# EAGLE design buttons_3 (EAGLE 5.09)
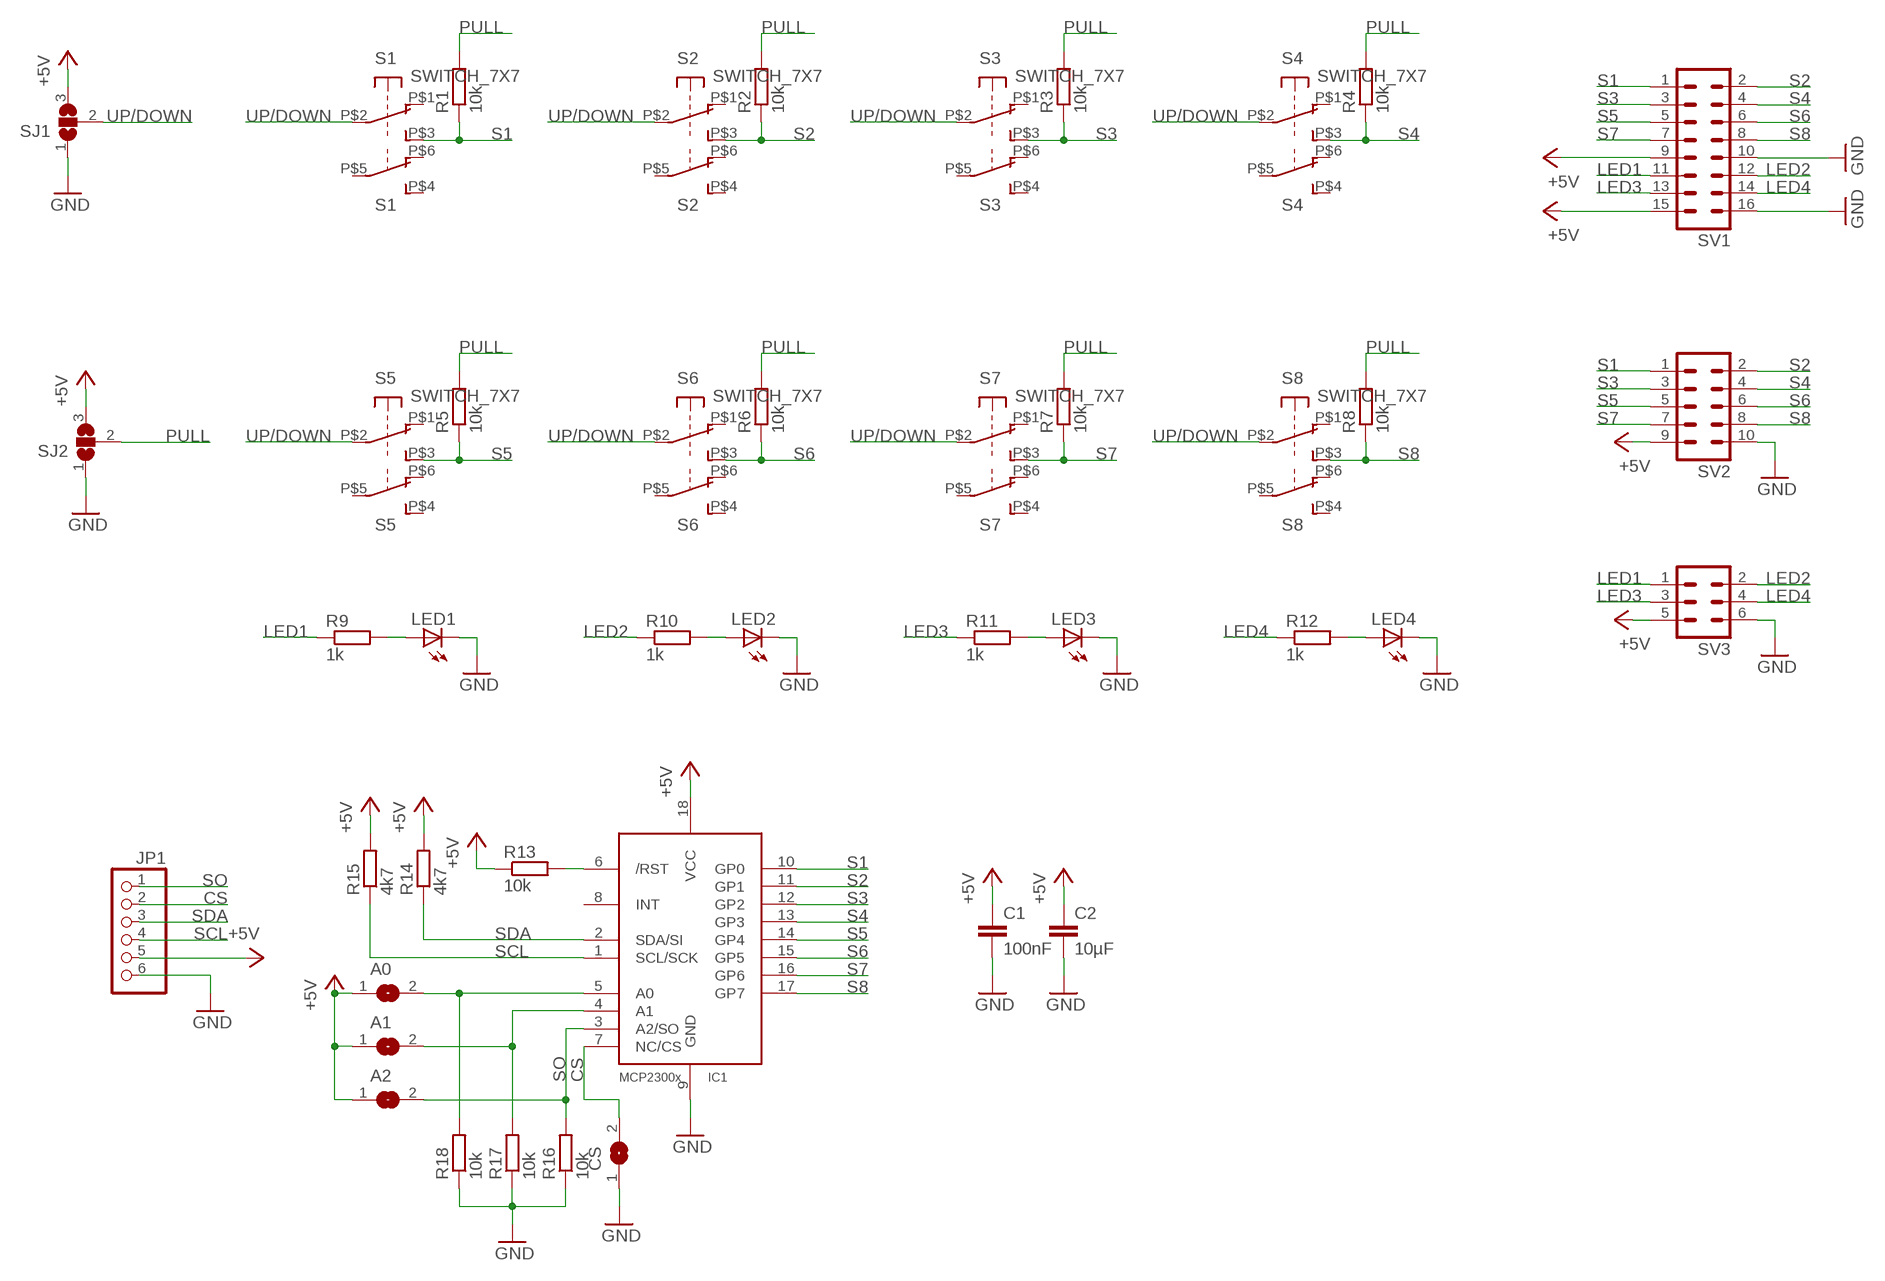
[diagram p0: schematic, sheet 1]

## Parts
A0  SJ  [SJ]
A1  SJ  [SJ]
A2  SJ  [SJ]
C1  100nF  C-EUC0805K  [C0805K]
C2  10µF  C-EUC0805K  [C0805K]
CS  SJ  [SJ]
IC1  MCP23008/MCP23S08/SO  [SO18W]
JP1  PINHD-1X6  [1X06]
LED1  LED5MM  [LED5MM]
LED2  LED5MM  [LED5MM]
LED3  LED5MM  [LED5MM]
LED4  LED5MM  [LED5MM]
R1  10k  R-EU_M0805  [M0805]
R2  10k  R-EU_M0805  [M0805]
R3  10k  R-EU_M0805  [M0805]
R4  10k  R-EU_M0805  [M0805]
R5  10k  R-EU_M0805  [M0805]
R6  10k  R-EU_M0805  [M0805]
R7  10k  R-EU_M0805  [M0805]
R8  10k  R-EU_M0805  [M0805]
R9  1k  R-EU_M0805  [M0805]
R10  1k  R-EU_M0805  [M0805]
R11  1k  R-EU_M0805  [M0805]
R12  1k  R-EU_M0805  [M0805]
R13  10k  R-EU_M0805  [M0805]
R14  4k7  R-EU_M0805  [M0805]
R15  4k7  R-EU_M0805  [M0805]
R16  10k  R-EU_M0805  [M0805]
R17  10k  R-EU_M0805  [M0805]
R18  10k  R-EU_M0805  [M0805]
S1  SWITCH_7X7  [SWITCH_7X7]
S2  SWITCH_7X7  [SWITCH_7X7]
S3  SWITCH_7X7  [SWITCH_7X7]
S4  SWITCH_7X7  [SWITCH_7X7]
S5  SWITCH_7X7  [SWITCH_7X7]
S6  SWITCH_7X7  [SWITCH_7X7]
S7  SWITCH_7X7  [SWITCH_7X7]
S8  SWITCH_7X7  [SWITCH_7X7]
SJ1  SJ2W  [SJ_2]
SJ2  SJ2W  [SJ_2]
SV1  ML16  [ML16]
SV2  ML10  [ML10]
SV3  ML6  [ML6]

## Nets
+5V: A0.1 A1.1 A2.1 C1.1 C2.1 IC1.18(VCC) JP1.5 R13.1 R14.2 R15.2 SJ1.3 SJ2.3 SV1.9 SV1.15 SV2.9 SV3.5
CS: CS.2 IC1.7(NC/CS) JP1.2
GND: C1.2 C2.2 CS.1 IC1.9(GND) JP1.6 LED1.K(C) LED2.K(C) LED3.K(C) LED4.K(C) R16.1 R17.1 R18.1 SJ1.1 SJ2.1 SV1.10 SV1.16 SV2.10 SV3.6
LED1: R9.1 SV1.11 SV3.1
LED2: R10.1 SV1.12 SV3.2
LED3: R11.1 SV1.13 SV3.3
LED4: R12.1 SV1.14 SV3.4
N$1: LED1.A R9.2
N$2: IC1.6(/RST) R13.2
N$3: LED2.A R10.2
N$4: LED3.A R11.2
N$5: LED4.A R12.2
N$9: A1.2 IC1.4(A1) R17.2
N$10: A0.2 IC1.5(A0) R18.2
PULL: R1.2 R2.2 R3.2 R4.2 R5.2 R6.2 R7.2 R8.2 SJ2.2
S1: IC1.10(GP0) R1.1 S1.P$3(1:S) SV1.1 SV2.1
S2: IC1.11(GP1) R2.1 S2.P$3(1:S) SV1.2 SV2.2
S3: IC1.12(GP2) R3.1 S3.P$3(1:S) SV1.3 SV2.3
S4: IC1.13(GP3) R4.1 S4.P$3(1:S) SV1.4 SV2.4
S5: IC1.14(GP4) R5.1 S5.P$3(1:S) SV1.5 SV2.5
S6: IC1.15(GP5) R6.1 S6.P$3(1:S) SV1.6 SV2.6
S7: IC1.16(GP6) R7.1 S7.P$3(1:S) SV1.7 SV2.7
S8: IC1.17(GP7) R8.1 S8.P$3(1:S) SV1.8 SV2.8
SCL: IC1.1(SCL/SCK) JP1.4 R15.1
SDA: IC1.2(SDA/SI) JP1.3 R14.1
SO: A2.2 IC1.3(A2/SO) JP1.1 R16.2
UP/DOWN: S1.P$2(1:P) S2.P$2(1:P) S3.P$2(1:P) S4.P$2(1:P) S5.P$2(1:P) S6.P$2(1:P) S7.P$2(1:P) S8.P$2(1:P) SJ1.2
Unconnected: IC1.8(INT) S1.P$1(1:O) S1.P$4(2:S) S1.P$5(2:P) S1.P$6(2:O) S2.P$1(1:O) S2.P$4(2:S) S2.P$5(2:P) S2.P$6(2:O) S3.P$1(1:O) S3.P$4(2:S) S3.P$5(2:P) S3.P$6(2:O) S4.P$1(1:O) S4.P$4(2:S) S4.P$5(2:P) S4.P$6(2:O) S5.P$1(1:O) S5.P$4(2:S) S5.P$5(2:P) S5.P$6(2:O) S6.P$1(1:O) S6.P$4(2:S) S6.P$5(2:P) S6.P$6(2:O) S7.P$1(1:O) S7.P$4(2:S) S7.P$5(2:P) S7.P$6(2:O) S8.P$1(1:O) S8.P$4(2:S) S8.P$5(2:P) S8.P$6(2:O)

## Library data of the parts
A0 A1 A2 CS = jumper:SJ: SMD solder JUMPER
C1 C2 = rcl:C-EU: CAPACITOR, European symbol
IC1 = Kim:MCP23008/MCP23S08: MCP23008 Inexpensive i2c i/o expander - 8 general purpose i/o pins with optional pullups
JP1 = pinhead:PINHD-1X6: PIN HEADER
LED1-LED4 = led:LED: LED OSRAM: - CHIPLED LG R971, LG N971, LY N971, LG Q971, LY Q971, LO R971, LY R971 LH N974, LH R974 LS Q976, LO Q976, LY Q976 LO Q996 - Hyper CHIPLED LW Q18S LB Q993, LB Q99A, LB R99A - SideLED LS A670, LO A670, LY A670, LG A670, LP A670 LB A673, LV A673, LT A673, LW A673 LH A674 LY A675 LS A676, LA A676, LO A676, LY A676, LW A676 LS A679, LY A679, LG A679 - Hyper Micro SIDELED® LS Y876, LA Y876, LO Y876, LY Y876 LT Y87S - SmartLED LW L88C, LW L88S LB L89C, LB L89S, LG L890 LS L89K, LO L89K, LY L89K LS L896, LA L896, LO L896, LY L896 - TOPLED LS T670, LO T670, LY T670, LG T670, LP T670 LSG T670, LSP T670, LSY T670, LOP T670, LYG T670 LG T671, LOG T671, LSG T671 LB T673, LV T673, LT T673, LW T673 LH T674 LS T676, LA T676, LO T676, LY T676, LB T676, LH T676, LSB T676, LW T676 LB T67C, LV T67C, LT T67C, LS T67K, LO T67K, LY T67K, LW E67C LS E67B, LA E67B, LO E67B, LY E67B, LB E67C, LV E67C, LT E67C LW T67C LS T679, LY T679, LG T679 LS T770, LO T770, LY T770, LG T770, LP T770 LB T773, LV T773, LT T773, LW T773 LH T774 LS E675, LA E675, LY E675, LS T675 LS T776, LA T776, LO T776, LY T776, LB T776 LHGB T686 LT T68C, LB T68C - Hyper Mini TOPLED® LB M676 - Mini TOPLED Santana® LG M470 LS M47K, LO M47K, LY M47K Source: http://www.osram.convergy.de LUXEON: - LUMILED® LXK2-PW12-R00, LXK2-PW12-S00, LXK2-PW14-U00, LXK2-PW14-V00 LXK2-PM12-R00, LXK2-PM12-S00, LXK2-PM14-U00 LXK2-PE12-Q00, LXK2-PE12-R00, LXK2-PE12-S00, LXK2-PE14-T00, LXK2-PE14-U00 LXK2-PB12-K00, LXK2-PB12-L00, LXK2-PB12-M00, LXK2-PB14-N00, LXK2-PB14-P00, LXK2-PB14-Q00 LXK2-PR12-L00, LXK2-PR12-M00, LXK2-PR14-Q00, LXK2-PR14-R00 LXK2-PD12-Q00, LXK2-PD12-R00, LXK2-PD12-S00 LXK2-PH12-R00, LXK2-PH12-S00 LXK2-PL12-P00, LXK2-PL12-Q00, LXK2-PL12-R00 Source: www.luxeon.com KINGBRIGHT: KA-3528ASYC Source: www.kingbright.com
R1-R18 = rcl:R-EU_: RESISTOR, European symbol
S1-S8 = Kim:SWITCH_7X7: SWITCH 7 x7 mm
SJ1 SJ2 = jumper:SJ2W: SMD solder JUMPER
SV1 = con-harting-ml:ML16: HARTING
SV2 = con-harting-ml:ML10: HARTING
SV3 = con-harting-ml:ML6: HARTING

## Board
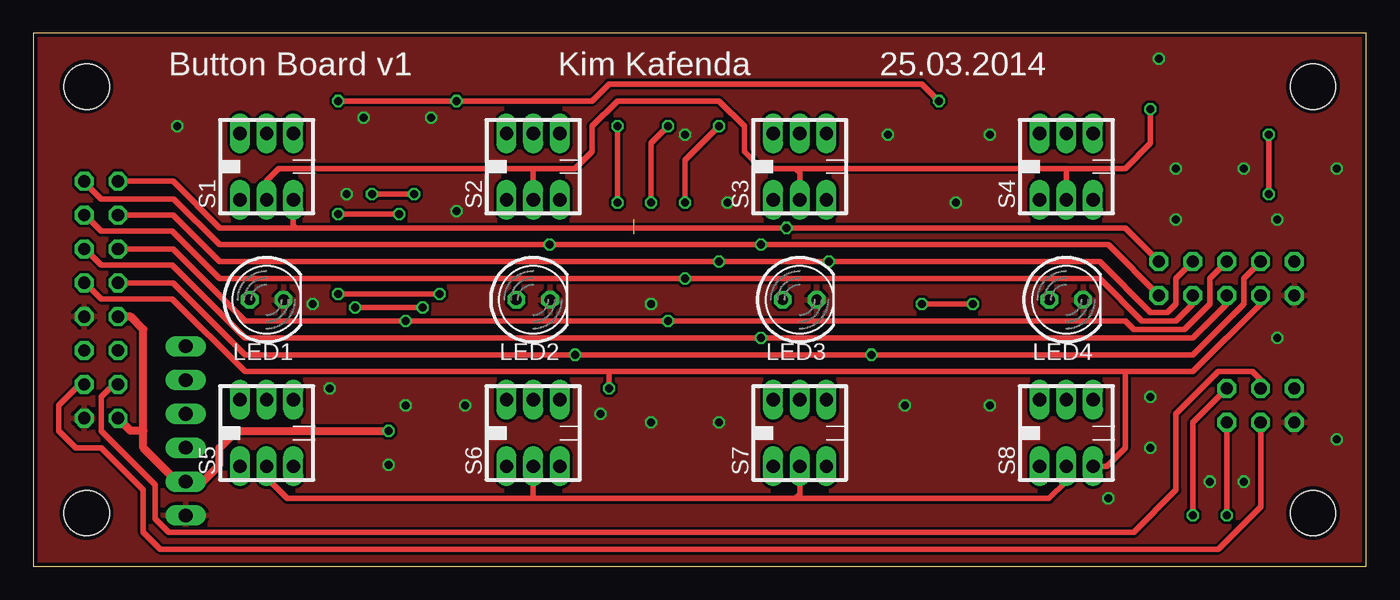
[diagram p1: board, top side]
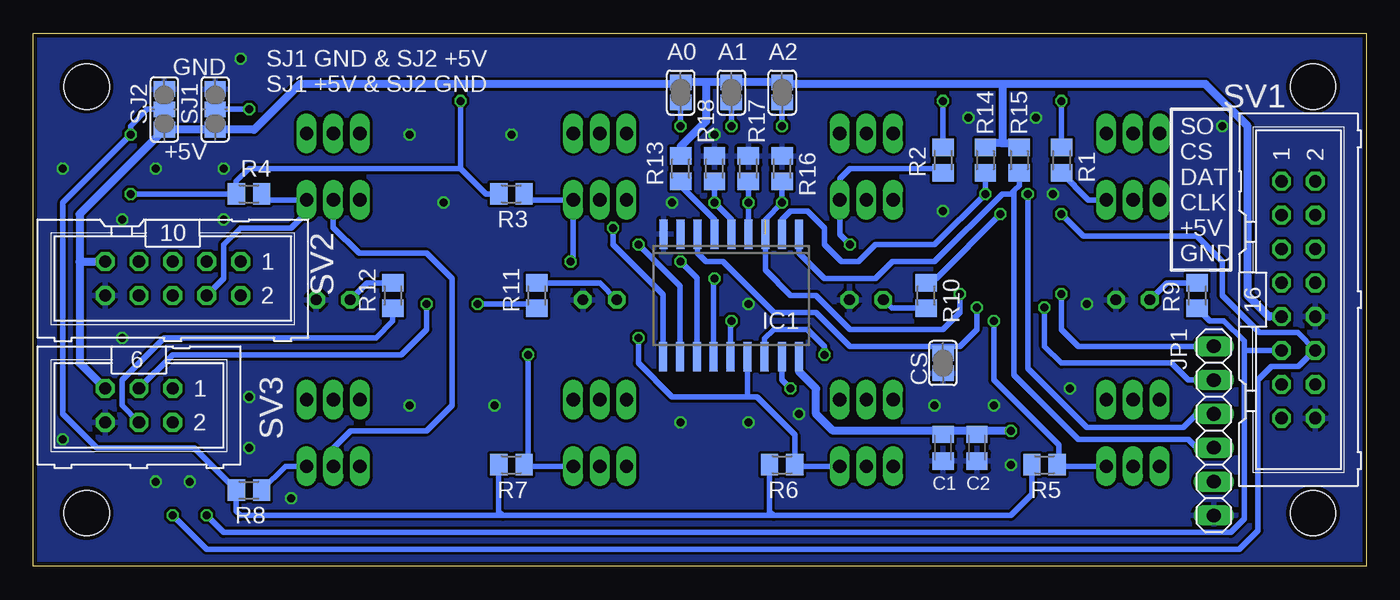
[diagram p2: board, bottom side, seen from below]

Size 100 x 40 mm. Coordinates in mm from the lower left corner, seen from the top.
Outline: 0,0 100,0 100,40 0,40 0,0
Copper layers (1*16): Top 0.035mm / dielectric 1.5mm / Bottom 0.035mm
Design rules "ITEADstudio_DRC *": minimum track width 16mil, minimum drill 0.3mm, track to track 8mil, track to pad 8mil, pad to pad 8mil, via to via 8mil, smd to smd 8mil, copper to edge 12mil, drill to drill 12mil, minimum pad ring 10mil, minimum via ring 6mil, stop-mask expansion 2mil, vias tented up to drill 100mil, thermal gap 10mil
Holes 3.4 mm at 4,4 4,36 96,36 96,4

### Footprints (pad centres in the part's own frame; a part is rotated, then mirrored left to right if it is on the bottom)
SJ = smd 1.168 x 1.6: 1 -0.762,0; 2 0.762,0
C0805K = smd 1.3 x 1.6: 1 -1,0; 2 1,0
SO18W = smd 0.6 x 2.2: 1 -4.445,-4.6; 2 -3.175,-4.6; 3 -1.905,-4.6; 4 -0.635,-4.6; 5 0.635,-4.6; 6 1.905,-4.6; 7 3.175,-4.6; 8 4.445,-4.6; 9 5.715,-4.6; 10 5.775,4.6; 11 4.505,4.6; 12 3.235,4.6; 13 1.965,4.6; 14 0.695,4.6; 15 -0.575,4.6; 16 -1.845,4.6; 17 -3.145,4.6; 18 -4.445,4.6
1X06 = drill 1.016 long: 1 -6.35,0; 2 -3.81,0; 3 -1.27,0; 4 1.27,0; 5 3.81,0; 6 6.35,0
LED5MM = drill 0.813 octagon: A -1.27,0; K 1.27,0
M0805 = smd 1.3 x 1.6: 1 -0.95,0; 2 0.95,0
SWITCH_7X7 = drill 1 long: P$1 -2,-2.5; P$2 0,-2.5; P$3 2,-2.5; P$4 2,2.5; P$5 0,2.5; P$6 -2,2.5
SJ_2 = smd 1.168 x 1.6: 1 -1.524,0; 2 0,0; 3 1.524,0
ML16 = drill 0.914 octagon: 1 -8.89,-1.27; 2 -8.89,1.27; 3 -6.35,-1.27; 4 -6.35,1.27; 5 -3.81,-1.27; 6 -3.81,1.27; 7 -1.27,-1.27; 8 -1.27,1.27; 9 1.27,-1.27; 10 1.27,1.27; 11 3.81,-1.27; 12 3.81,1.27; 13 6.35,-1.27; 14 6.35,1.27; 15 8.89,-1.27; 16 8.89,1.27
ML10 = drill 0.914 octagon: 1 -5.08,-1.27; 2 -5.08,1.27; 3 -2.54,-1.27; 4 -2.54,1.27; 5 0,-1.27; 6 0,1.27; 7 2.54,-1.27; 8 2.54,1.27; 9 5.08,-1.27; 10 5.08,1.27
ML6 = drill 0.914 octagon: 1 -2.54,-1.27; 2 -2.54,1.27; 3 0,-1.27; 4 0,1.27; 5 2.54,-1.27; 6 2.54,1.27

### Placement (x,y rotation side)
A0  51.44,35.56 270 bottom
A1  47.62,35.56 270 bottom
A2  43.81,35.56 270 bottom
C1  31.75,8.89 270 bottom
C2  29.21,8.89 270 bottom
CS  31.75,15.24 90 bottom
IC1  46.99,20.32 180 bottom
JP1  11.43,10.16 270 bottom
LED1  17.5,20 0 top
LED2  37.5,20 0 top
LED3  57.5,20 0 top
LED4  77.5,20 0 top
R1  22.86,30.48 90 bottom
R2  31.75,30.48 90 bottom
R3  64.14,27.94 180 bottom
R4  83.82,27.94 180 bottom
R5  24.13,7.62 180 bottom
R6  43.81,7.62 180 bottom
R7  64.14,7.62 180 bottom
R8  83.82,5.71 180 bottom
R9  12.7,20.32 90 bottom
R10  33.02,20.32 270 bottom
R11  62.23,20.32 90 bottom
R12  73.03,20.32 90 bottom
R13  51.44,29.84 270 bottom
R14  28.57,30.48 90 bottom
R15  26.04,30.48 90 bottom
R16  43.81,29.84 270 bottom
R17  46.35,29.84 270 bottom
R18  48.9,29.84 270 bottom
S1  17.5,30 0 top
S2  37.5,30 0 top
S3  57.5,30 0 top
S4  77.5,30 0 top
S5  17.5,10 0 top
S6  37.5,10 0 top
S7  57.5,10 0 top
S8  77.5,10 0 top
SJ1  86.36,34.29 270 bottom
SJ2  90.17,34.29 270 bottom
SV1  5.08,20 270 bottom
SV2  89.53,21.59 180 bottom
SV3  92.08,12.06 180 bottom

### Tracks (layer width: path | path; a pad name or v marks a point on that pad's centre or on a via)
+5V  (via drill 0.6)
  Top 0.61: SV1.15 7.3,10.16 8.26,10.16 | 8.26,10.16 8.26,17.77 7.3,18.73 SV1.9 | 8.26,10.16 8.26,8.89 10.79,6.35 JP1.5 12.7,6.35 13.97,7.62 13.97,8.89 15.24,10.16 v26.67,10.16
  Bottom 0.406: R13.1 51.44,31.11 | IC1.18 42.55,15.88 | 29.21,10.16 C2.1 | 31.75,10.16 C1.1
  Bottom 0.61: 49.53,36.32 A1.1 A2.1 43.69,36.2 27.3,36.2 | 49.53,36.32 A0.1 51.56,36.2 80.01,36.2 83.44,32.77 SJ1.3 SJ2.3 96.52,26.42 96.52,22.86 | SV3.5 96.52,15.24 96.52,22.86 | 96.52,22.86 SV2.9 | 27.3,31.75 26.36,31.75 R15.2 | 27.3,31.75 28.25,31.75 R14.2 | 27.3,36.2 12.06,36.2 8.89,33.02 8.89,20.32 7.3,18.73 SV1.9 | 27.3,36.2 27.3,31.75 | 49.53,36.32 49.53,33.4 51.44,31.5 R13.1 | IC1.18 42.55,14.61 41.27,13.34 41.27,11.43 40.01,10.16 31.75,10.16 29.21,10.16 v26.67,10.16
CS  (via drill 0.6)
  Top 0.406: v24.13,19.43 v29.21,19.43
  Bottom 0.406: IC1.7 50.16,23.5 49.53,22.86 48.26,22.86 44.45,19.05 41.27,19.05 38.73,16.51 31.75,16.51 | v24.13,19.43 24.13,16.51 22.86,15.24 14.61,15.24 13.34,13.97 JP1.2 | v29.21,19.43 29.21,17.78 30.48,16.51 31.75,16.51 | 31.75,16.51 CS.2
GND  (via drill 0.6)
  other vias: 48.9,32.38 64.14,32.38 71.75,32.38 69.22,27.3 31.75,26.67 23.5,27.94 20.95,19.68 27.94,12.06 26.67,7.62 52.07,27.3 46.35,10.79 42.55,11.43 32.38,12.06 22.23,13.34 24.77,33.66 29.84,33.66 10.79,33.02 51.44,10.79 65.41,12.06 71.75,12.06 93.34,17.14 93.34,26.04 85.72,26.04 85.72,29.84 90.81,29.84 84.45,38.1 97.79,29.84 97.79,9.53 83.82,8.89 46.35,19.68 88.27,6.35 90.81,6.35 80.64,5.08 83.82,12.7
  pour Bottom: -1.27,-1.27 101.6,-1.27 101.6,41.91 -1.27,41.91
  pour Top: -1.27,-1.27 101.6,-1.27 101.6,41.91 -1.27,41.91
LED1  (via drill 0.6)
  Top 0.406: v87,3.81 87,10.79 SV3.1
  Bottom 0.406: SV1.11 9.08,16.19 9.14,16.26 | v87,3.81 85.72,2.54 10.16,2.54 9.14,3.56 9.14,16.26 | 9.14,16.26 9.14,16.89 10.67,18.41 11.74,18.41 R9.1
LED2  (via drill 0.6)
  Top 0.406: v89.53,3.81 SV3.2 | v22.86,26.42 v27.43,26.42
  Bottom 0.406: v89.53,3.81 87,1.27 9.53,1.27 8.13,2.67 8.13,13.97 7.11,14.99 5.08,14.99 3.88,16.19 SV1.12 5.15,17.53 8,17.53 10.79,20.32 10.79,22.86 12.7,24.77 21.21,24.77 v22.86,26.42 | R10.1 33.02,21.59 32.26,21.59 v27.43,26.42
LED3  (via drill 0.6)
  Top 0.406: SV1.13 6.03,13.65 5.08,12.7 5.08,10.16 9.14,6.1 9.14,3.56 10.16,2.54 82.55,2.54 85.72,5.71 85.72,11.43 88.9,14.61 91.44,14.61 92.08,13.97 SV3.3 | v70.48,19.68 v66.67,19.68
  Bottom 0.406: SV3.3 89.53,15.88 72.39,15.88 70.48,17.78 v70.48,19.68 | v66.67,19.68 62.55,19.68 R11.1
LED4
  Top 0.406: SV1.14 3.49,13.65 1.91,12.06 1.91,10.16 3.17,8.89 5.08,8.89 8.26,5.71 8.26,2.54 9.53,1.27 88.9,1.27 92.08,4.45 SV3.4
  Bottom 0.406: R12.1 73.03,18.41 74.3,17.14 90.17,17.14 93.34,13.97 93.34,12.06 SV3.4
N$1
  Bottom 0.406: R9.2 14.96,21.27 LED1.A
N$2
  Bottom 0.406: IC1.6 48.9,26.04 51.44,28.57 R13.2
N$3
  Bottom 0.406: R10.2 35.6,19.37 LED2.A
N$4
  Bottom 0.406: R11.2 57.5,21.27 LED3.A
N$5
  Bottom 0.406: R12.2 74.96,21.27 LED4.A
N$9  (via drill 0.6)
  Top 0.406: v47.62,33.02 46.35,31.75 v46.35,27.3
  Bottom 0.406: IC1.4 46.35,26.67 v46.35,27.3 R17.2 | v47.62,33.02 A1.2
N$10  (via drill 0.6)
  Top 0.406: v48.9,27.3 48.9,30.48 v51.44,33.02
  Bottom 0.406: IC1.5 47.62,26.04 v48.9,27.3 R18.2 | v51.44,33.02 A0.2
PULL  (via drill 0.6)
  Top 0.406: v92.71,32.38 v92.71,27.94 | v22.86,34.92 v31.75,34.92 41.91,34.92 43.18,36.2 66.67,36.2 v67.94,34.92
  Bottom 0.406: R5.2 25.08,5.4 26.67,3.81 44.45,3.81 | 44.45,3.81 64.77,3.81 | R7.2 65.08,4.12 64.77,3.81 | R6.2 44.77,4.12 44.45,3.81 | R3.2 66.04,27.94 67.94,29.84 | 67.94,29.84 83.82,29.84 84.77,28.89 R4.2 v92.71,27.94 | 64.77,3.81 84.45,3.81 84.77,4.12 R8.2 87.94,8.89 95.25,8.89 97.79,11.43 97.79,27.3 v92.71,32.38 92.71,33.02 91.44,34.29 SJ2.2 | 67.94,29.84 v67.94,34.92 | v22.86,34.92 R1.2 | v31.75,34.92 R2.2
S1  (via drill 0.6)
  Top 0.406: SV1.1 10.48,28.89 13.97,25.4 19.68,25.4 | SV2.1 81.92,25.4 v56.52,25.4 19.68,25.4 | S1.P$3 19.5,25.59 19.68,25.4
  Bottom 0.406: S1.P$3 20.83,27.5 R1.1 | IC1.10 52.77,20.38 56.52,24.13 v56.52,25.4
S2  (via drill 0.6)
  Top 0.406: SV1.2 3.81,28.83 5.08,27.56 10.54,27.56 13.97,24.13 38.1,24.13 v38.73,24.13 v54.61,24.13 80.64,24.13 SV2.2
  Bottom 0.406: R2.1 32.06,29.84 38.73,29.84 39.5,29.08 S2.P$3 39.5,24.89 v38.73,24.13 | IC1.11 51.49,21.02 v54.61,24.13
S3  (via drill 0.6)
  Top 0.406: SV1.3 10.48,26.35 13.97,22.86 v51.44,22.86 | SV2.3 85.72,21.59 85.72,19.68 85.09,19.05 83.82,19.05 80.01,22.86 v59.69,22.86 v51.44,22.86 | v51.44,22.86 50.8,22.86
  Bottom 0.406: R3.1 62.74,27.5 S3.P$3 59.5,23.05 v59.69,22.86 | IC1.12 50.23,21.65 v51.44,22.86
S4  (via drill 0.6)
  Top 0.406: SV1.4 3.88,26.35 5.08,25.15 10.41,25.15 13.97,21.59 v48.9,21.59 49.53,21.59 80.01,21.59 83.19,18.41 85.72,18.41 87,19.68 SV2.4
  Bottom 0.406: R4.1 82.43,27.5 S4.P$3 79.5,26.55 80.64,25.4 84.45,25.4 85.72,24.13 85.72,21.59 SV2.4 | IC1.13 48.95,21.53 v48.9,21.59
S5  (via drill 0.6)
  Top 0.406: SV1.5 10.48,23.81 15.88,18.41 v27.94,18.41 v47.62,18.41 81.92,18.41 82.55,17.78 86.36,17.78 88.27,19.68 88.27,21.59 SV2.5
  Bottom 0.406: S5.P$3 23.06,7.5 | 23.06,7.5 R5.1 | IC1.14 47.69,18.36 v47.62,18.41 | 23.06,7.5 23.06,9.09 27.94,13.97 v27.94,18.41
S6  (via drill 0.6)
  Top 0.406: SV1.6 3.88,23.81 5.08,22.61 10.41,22.61 15.88,17.14 v54.61,17.14 87,17.14 89.53,19.68 SV2.6
  Bottom 0.406: S6.P$3 42.74,7.5 R6.1 42.87,9.85 45.72,12.7 46.35,12.7 | IC1.15 46.41,12.76 46.35,12.7 | 46.35,12.7 52.07,12.7 54.61,15.24 v54.61,17.14
S7  (via drill 0.6)
  Top 0.406: SV1.7 10.48,21.27 15.88,15.88 v40.64,15.88 v62.87,15.88 87,15.88 90.81,19.68 90.81,21.59 SV2.7
  Bottom 0.406: v62.87,15.88 62.87,7.62 R7.1 63.06,7.5 S7.P$3 | IC1.16 45.15,17.09 44.45,17.78 41.91,17.78 40.64,16.51 v40.64,15.88
S8  (via drill 0.6)
  Top 0.406: SV1.8 3.88,21.27 5.08,20.07 10.41,20.07 15.88,14.61 43.18,14.61 | 43.18,14.61 81.92,14.61 | 81.92,14.61 87,14.61 92.08,19.68 SV2.8 | S8.P$3 80.53,7.5 81.92,8.89 81.92,14.61 | 43.18,14.61 v43.18,13.34
  Bottom 0.406: R8.1 81.08,7.5 S8.P$3 | IC1.17 43.84,14 v43.18,13.34
SCL
  Bottom 0.406: R15.1 26.04,28.57 26.42,28.19 | IC1.1 42.55,23.5 40.64,21.59 36.83,21.59 35.56,22.86 32.38,22.86 27.3,27.94 26.67,27.94 26.42,28.19 | 26.42,28.19 26.42,14.35 21.59,9.53 13.34,9.53 12.7,8.89 JP1.4
SDA  (via drill 0.6)
  Top 0.406: v25.4,27.94 v28.57,27.94
  Bottom 0.406: IC1.2 43.81,26.04 43.18,26.67 41.91,26.67 40.64,25.4 40.64,24.13 39.37,22.86 38.1,22.86 36.83,24.13 32.38,24.13 v28.57,27.94 R14.1 | v25.4,27.94 25.4,14.86 20.95,10.41 13.72,10.41 12.7,11.43 JP1.3
SO  (via drill 0.6)  (1 unrouted)
  Top 0.406: v43.81,27.3 v43.81,33.02 | v22.86,20.45 v30.48,20.45
  Bottom 0.406: v43.81,33.02 A2.2 | 45.09,26.04 v43.81,27.3 R16.2 | IC1.3 45.09,22.23 43.18,20.32 41.27,20.32 38.73,17.78 31.75,17.78 30.48,19.05 v30.48,20.45 | v22.86,20.45 22.86,17.78 21.59,16.51 JP1.1
UP/DOWN  (via drill 0.6)
  Top 0.406: v83.82,34.29 83.82,31.75 81.92,29.84 77.47,29.84 | 77.47,28.57 77.47,27.53 S4.P$2 77.5,29.82 77.47,29.84 | S5.P$2 17.5,6.63 19.05,5.08 37.47,5.08 | 37.47,5.08 57.15,5.08 | 57.15,5.08 76.2,5.08 77.47,6.35 77.47,7.47 S8.P$2 | S7.P$2 57.5,5.43 57.15,5.08 | S6.P$2 37.5,5.12 37.47,5.08 | S1.P$2 17.5,28.93 18.41,29.84 36.83,29.84 37.47,29.84 | 37.5,28.54 S2.P$2 37.5,29.81 37.47,29.84 | 57.15,29.84 54.61,29.84 53.34,31.11 53.34,33.02 51.44,34.92 43.81,34.92 41.91,33.02 41.91,31.11 40.64,29.84 37.47,29.84 | 77.47,29.84 57.15,29.84 | S3.P$2 57.5,29.5 57.15,29.84
  Bottom 0.406: v83.82,34.29 SJ1.2 | S4.P$2 77.5,25.43 75.56,23.5 70.48,23.5 68.58,21.59 68.58,12.06 70.48,10.16 76.2,10.16 77.47,8.89 77.47,7.53 S8.P$2

### Text on the board
tPlace: Button Board v1 | Kim Kafenda | 25.03.2014
bPlace: SJ1 GND & SJ2 +5V | GND | SJ1 +5V & SJ2 GND | SO | CS | +5V | DAT | CLK | +5V | GND